# Altium schematic sheet Module Connector.SchDoc
size A
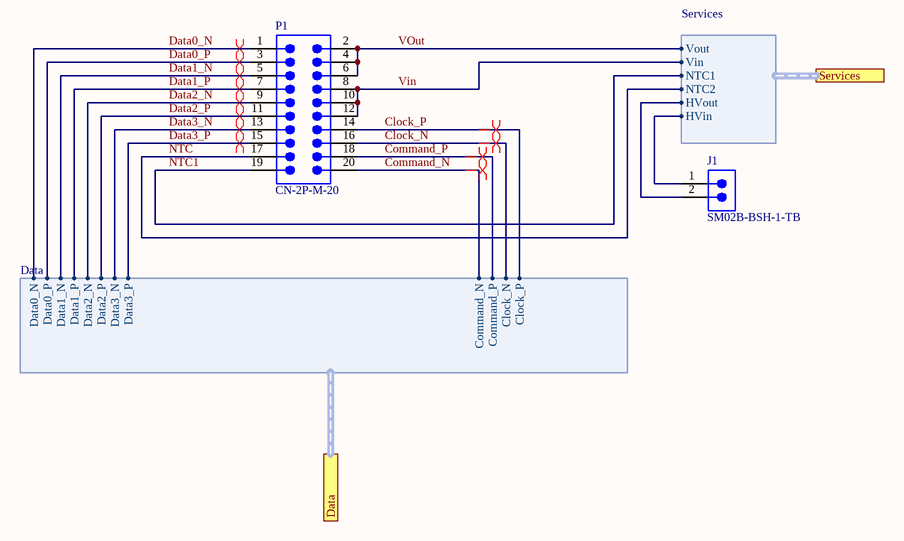
[diagram p0: Module Connector.SchDoc]

## Parts
J1  SM02B-BSH-1-TB  [SM02B-BSH-1-TB]
P1  CN-2P-M-20  [SLH-010-1.50-G-D-A]

## Ports
Data (harness Data), Services (harness Services)

## Harnesses
Services: Vin, Vout, HVin, HVout, NTC1, NTC2
Data: Data0_N, Data0_P, Data1_N, Data1_P, Data2_N, Data2_P, Data3_N, Data3_P, Clock_P, Clock_N, Command_P, Command_N

## Nets
Clock_N: P1.16 ; port Data.Clock_N
Clock_P: P1.14 ; port Data.Clock_P
Command_N: P1.20 ; port Data.Command_N
Command_P: P1.18 ; port Data.Command_P
Data0_N: P1.1 ; port Data.Data0_N
Data0_P: P1.3 ; port Data.Data0_P
Data1_N: P1.5 ; port Data.Data1_N
Data1_P: P1.7 ; port Data.Data1_P
Data2_N: P1.9 ; port Data.Data2_N
Data2_P: P1.11 ; port Data.Data2_P
Data3_N: P1.13 ; port Data.Data3_N
Data3_P: P1.15 ; port Data.Data3_P
NTC: P1.17 ; port Services.NTC2
NTC1: P1.19 ; port Services.NTC1
Vin: P1.8 P1.10 P1.12 ; port Services.Vin
VOut: P1.2 P1.4 P1.6 ; port Services.Vout
NetJ1_1: J1.1 ; port Services.HVin
NetJ1_2: J1.2 ; port Services.HVout

## Layout directives
differential pair: Clock_N, Clock_P, Command_N, Command_P, Data0_N, Data0_P, Data1_N, Data1_P, Data2_N, Data2_P, Data3_N, Data3_P

## Library data of the parts
J1 = CN-1S-M-2: 1 Row, Socket, 0 Mounting Holes, Male Pins, 2 Pins
P1 = CN-2P-M-20: Board-to-Board Connector, Vertical, 2-Row, Pitch 0.80mm, 20-Position, Male